# Altium schematic sheet MCU.SchDoc
size A; SheetNumber: 1; SheetTotal: 2
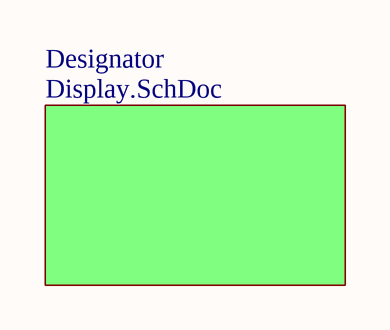
[diagram p0: MCU.SchDoc]

## Sub-sheets
Designator = Display.SchDoc: no entries